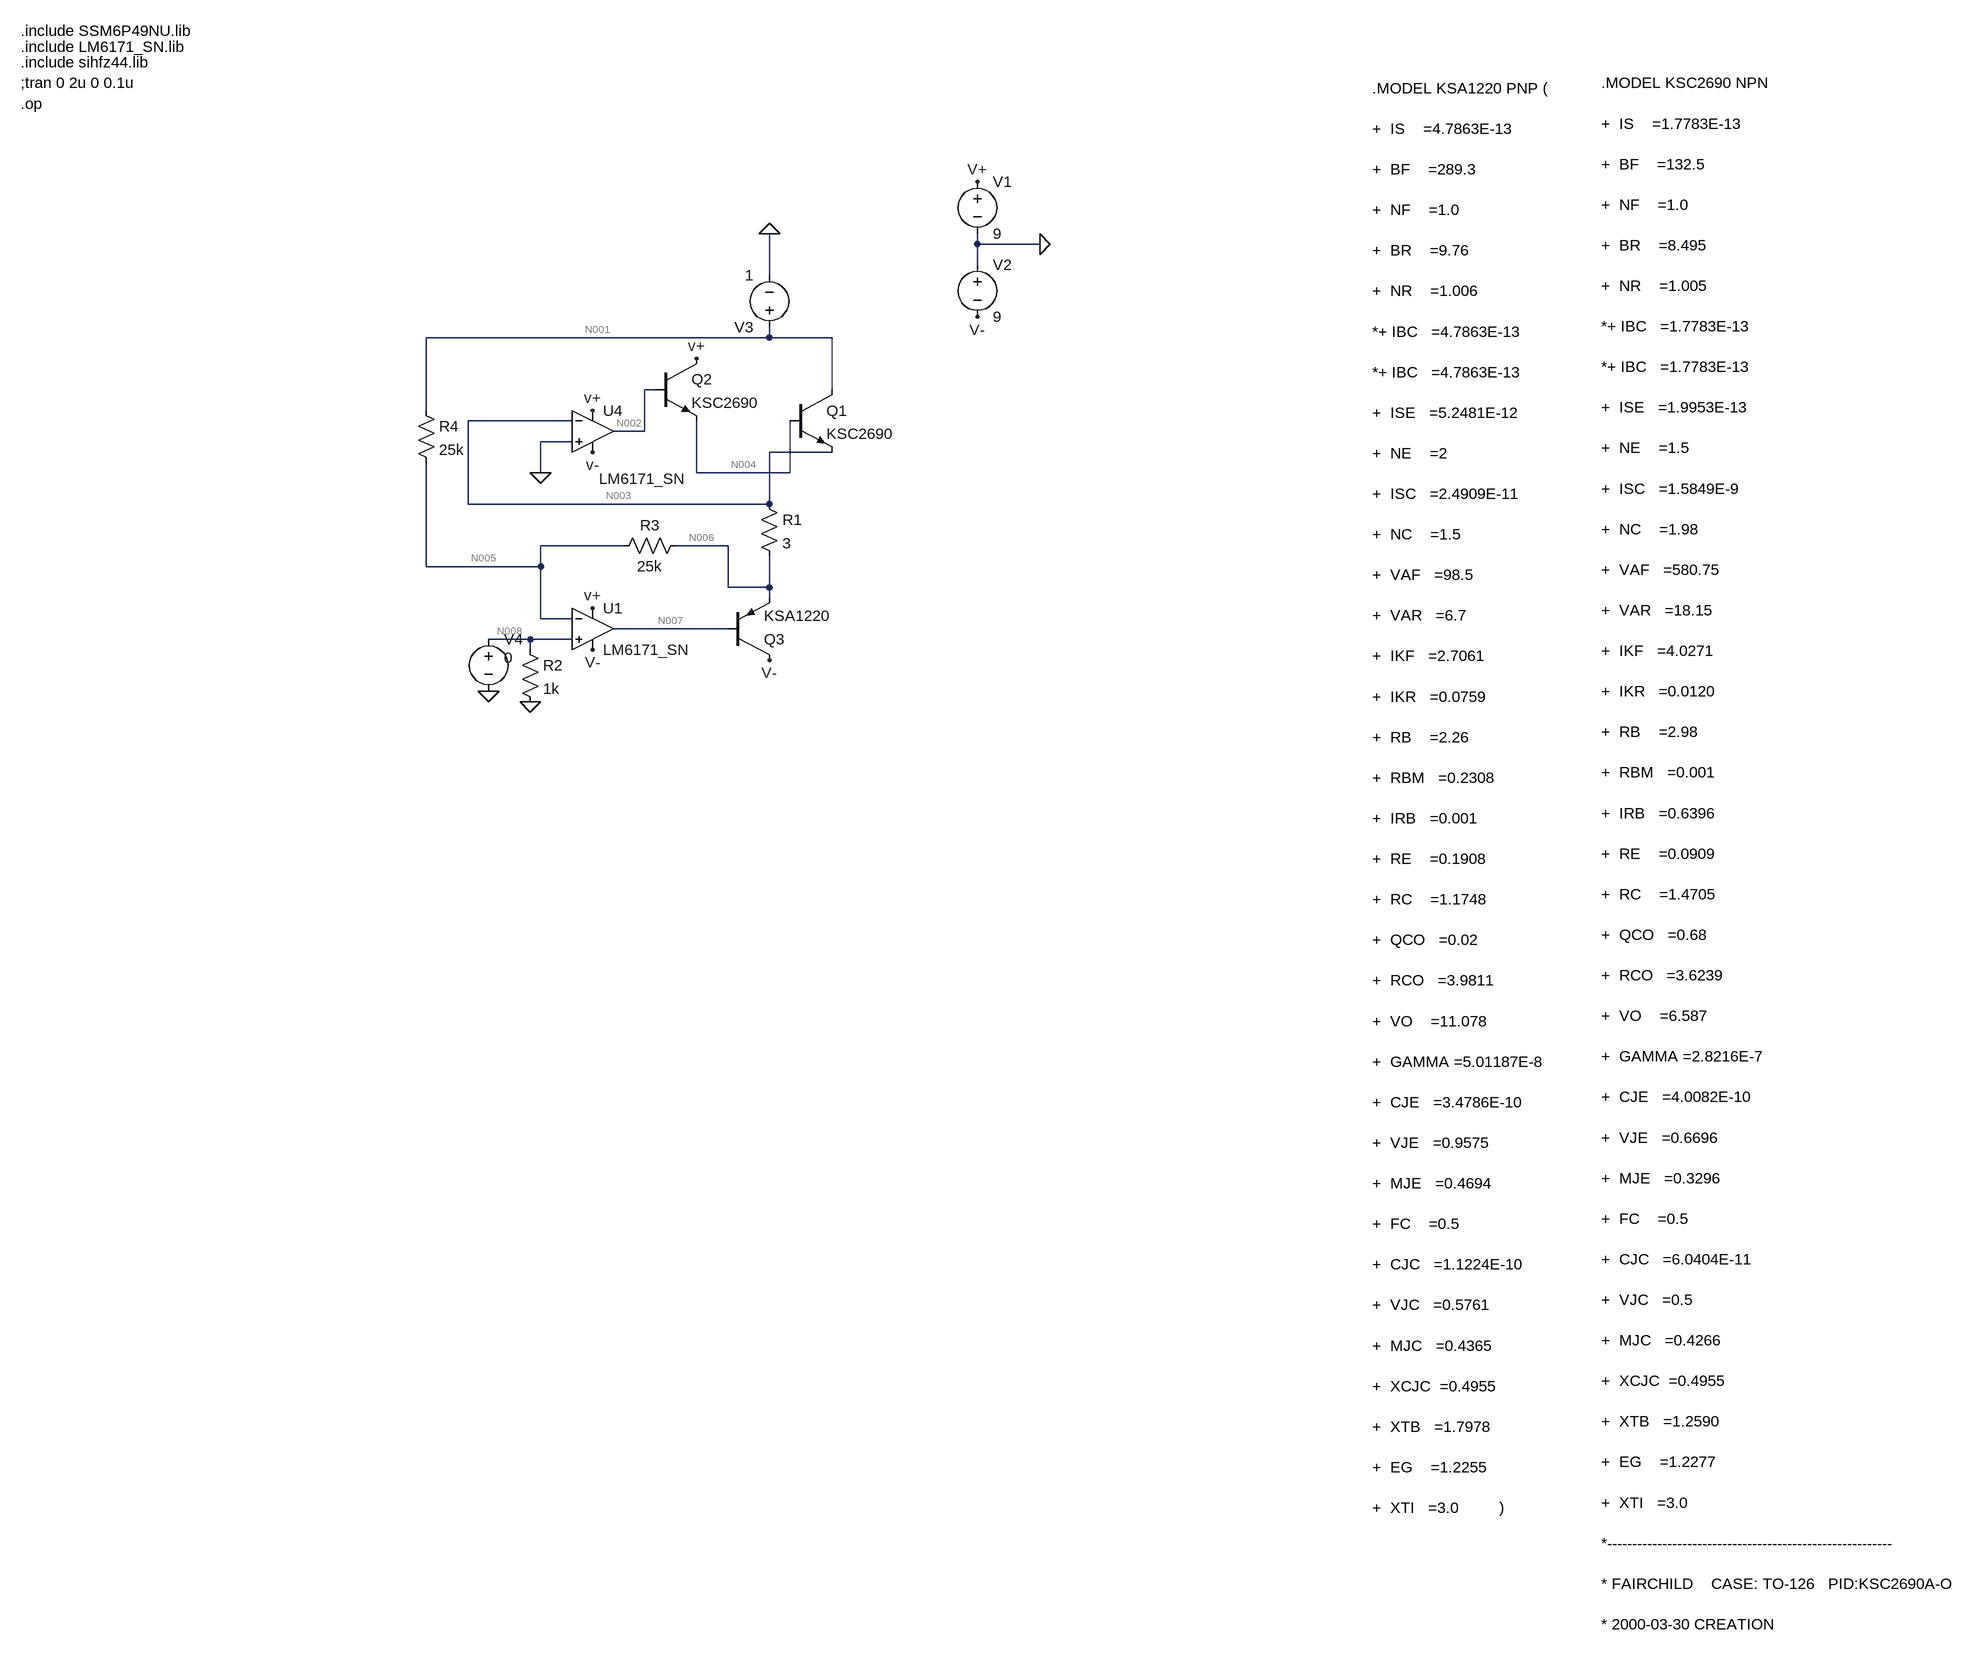
[diagram p0: schematic DC-DC_load.asc]
DC-DC_load.asc, the LTspice schematic file:
Version 4
SHEET 1 2640 680
WIRE 1056 -160 1056 -176
WIRE 1152 -160 1056 -160
WIRE 1056 -128 1056 -160
WIRE 736 -112 736 -176
WIRE 736 -16 736 -32
WIRE 736 -16 208 -16
WIRE 832 -16 736 -16
WIRE 560 64 544 64
WIRE 832 64 832 -16
WIRE 208 96 208 -16
WIRE 432 112 272 112
WIRE 544 128 544 64
WIRE 544 128 496 128
WIRE 432 144 384 144
WIRE 832 160 736 160
WIRE 384 192 384 144
WIRE 624 192 624 112
WIRE 768 192 768 112
WIRE 768 192 624 192
WIRE 272 240 272 112
WIRE 736 240 736 160
WIRE 736 240 272 240
WIRE 512 304 384 304
WIRE 672 304 592 304
WIRE 208 336 208 176
WIRE 384 336 384 304
WIRE 384 336 208 336
WIRE 672 368 672 304
WIRE 736 368 736 320
WIRE 736 368 672 368
WIRE 736 384 736 368
WIRE 384 416 384 336
WIRE 432 416 384 416
WIRE 672 432 496 432
WIRE 368 448 304 448
WIRE 432 448 368 448
WIRE 368 464 368 448
FLAG 464 96 v+
FLAG 464 160 v-
FLAG 1152 -160 0
FLAG 1056 -256 V+
FLAG 1056 -48 V-
FLAG 384 192 0
FLAG 736 480 V-
FLAG 464 464 V-
FLAG 464 400 v+
FLAG 736 -176 0
FLAG 368 544 0
FLAG 624 16 v+
FLAG 304 528 0
SYMBOL Opamps\\opamp2 464 368 R0
SYMATTR InstName U1
SYMATTR Value LM6171_SN
SYMBOL Opamps\\opamp2 464 64 R0
WINDOW 3 10 137 Left 2
SYMATTR Value LM6171_SN
SYMATTR InstName U4
SYMBOL voltage 1056 -272 R0
WINDOW 123 0 0 Left 2
WINDOW 39 0 0 Left 2
SYMATTR InstName V1
SYMATTR Value 9
SYMBOL voltage 1056 -144 R0
WINDOW 123 0 0 Left 2
WINDOW 39 0 0 Left 2
SYMATTR InstName V2
SYMATTR Value 9
SYMBOL npn 768 64 R0
SYMATTR InstName Q1
SYMATTR Value KSC2690
SYMBOL pnp 672 480 M180
SYMATTR InstName Q3
SYMATTR Value KSA1220
SYMBOL res 720 224 R0
SYMATTR InstName R1
SYMATTR Value 3
SYMBOL voltage 736 -16 R180
WINDOW 123 0 0 Left 2
WINDOW 39 -118 -3 Left 2
SYMATTR InstName V3
SYMATTR Value 1
SYMBOL voltage 304 432 R0
WINDOW 3 24 44 Left 2
WINDOW 123 0 0 Left 2
WINDOW 39 0 0 Left 2
SYMATTR Value 0
SYMATTR InstName V4
SYMBOL npn 560 16 R0
SYMATTR InstName Q2
SYMATTR Value KSC2690
SYMBOL res 352 448 R0
SYMATTR InstName R2
SYMATTR Value 1k
SYMBOL res 608 288 R90
WINDOW 0 0 56 VBottom 2
WINDOW 3 32 56 VTop 2
SYMATTR InstName R3
SYMATTR Value 25k
SYMBOL res 192 80 R0
SYMATTR InstName R4
SYMATTR Value 25k
TEXT -416 -376 Left 2 !.op
TEXT -416 -464 Left 2 !.include LM6171_SN.lib
TEXT -416 -408 Left 2 !;tran 0 2u 0 0.1u
TEXT -416 -440 Left 2 !.include sihfz44.lib
TEXT -416 -488 Left 2 !.include SSM6P49NU.lib
TEXT 1664 -400 Left 2 !.MODEL KSA1220 PNP ( \n\n+  IS    =4.7863E-13      \n\n+  BF    =289.3\n\n+  NF    =1.0 \n\n+  BR    =9.76\n\n+  NR    =1.006\n\n*+ IBC   =4.7863E-13\n\n*+ IBC   =4.7863E-13\n\n+  ISE   =5.2481E-12\n\n+  NE    =2\n\n+  ISC   =2.4909E-11\n\n+  NC    =1.5\n\n+  VAF   =98.5\n\n+  VAR   =6.7\n\n+  IKF   =2.7061\n\n+  IKR   =0.0759\n\n+  RB    =2.26\n\n+  RBM   =0.2308\n\n+  IRB   =0.001\n\n+  RE    =0.1908\n\n+  RC    =1.1748\n\n+  QCO   =0.02\n\n+  RCO   =3.9811\n\n+  VO    =11.078\n\n+  GAMMA =5.01187E-8\n\n+  CJE   =3.4786E-10\n\n+  VJE   =0.9575\n\n+  MJE   =0.4694\n\n+  FC    =0.5\n\n+  CJC   =1.1224E-10\n\n+  VJC   =0.5761\n\n+  MJC   =0.4365\n\n+  XCJC  =0.4955   \n\n+  XTB   =1.7978    \n\n+  EG    =1.2255 \n\n+  XTI   =3.0         )
TEXT 2016 -408 Left 2 !.MODEL KSC2690 NPN\n\n+  IS    =1.7783E-13      \n\n+  BF    =132.5\n\n+  NF    =1.0 \n\n+  BR    =8.495\n\n+  NR    =1.005\n\n*+ IBC   =1.7783E-13 \n\n*+ IBC   =1.7783E-13 \n\n+  ISE   =1.9953E-13\n\n+  NE    =1.5\n\n+  ISC   =1.5849E-9\n\n+  NC    =1.98\n\n+  VAF   =580.75\n\n+  VAR   =18.15\n\n+  IKF   =4.0271\n\n+  IKR   =0.0120\n\n+  RB    =2.98\n\n+  RBM   =0.001\n\n+  IRB   =0.6396\n\n+  RE    =0.0909\n\n+  RC    =1.4705\n\n+  QCO   =0.68\n\n+  RCO   =3.6239\n\n+  VO    =6.587\n\n+  GAMMA =2.8216E-7\n\n+  CJE   =4.0082E-10\n\n+  VJE   =0.6696\n\n+  MJE   =0.3296\n\n+  FC    =0.5\n\n+  CJC   =6.0404E-11\n\n+  VJC   =0.5\n\n+  MJC   =0.4266\n\n+  XCJC  =0.4955   \n\n+  XTB   =1.2590    \n\n+  EG    =1.2277 \n\n+  XTI   =3.0         \n\n*---------------------------------------------------------\n\n* FAIRCHILD    CASE: TO-126   PID:KSC2690A-O\n\n* 2000-03-30 CREATION

The netlist it stands for:
* DC-DC_load.asc
XU1 N008 N005 v+ v- N007 LM6171_SN  ; pins In+ In- V+ V- OUT
XU4 0 N003 v+ v- N002 LM6171_SN  ; pins In+ In- V+ V- OUT
V1 v+ 0 9
V2 0 v- 9
Q1 N001 N004 N003 0 KSC2690
Q3 v- N007 N006 0 KSA1220
R1 N003 N006 3
V3 N001 0 1
V4 N008 0 0
Q2 v+ N002 N004 0 KSC2690
R2 N008 0 1k
R3 N006 N005 25k
R4 N001 N005 25k
.model NPN NPN
.model PNP PNP
.lib standard.bjt
.op
.include LM6171_SN.lib
;tran 0 2u 0 0.1u
.include sihfz44.lib
.include SSM6P49NU.lib
.MODEL KSA1220 PNP (
+  IS    =4.7863E-13
+  BF    =289.3
+  NF    =1.0
+  BR    =9.76
+  NR    =1.006
*+ IBC   =4.7863E-13
*+ IBC   =4.7863E-13
+  ISE   =5.2481E-12
+  NE    =2
+  ISC   =2.4909E-11
+  NC    =1.5
+  VAF   =98.5
+  VAR   =6.7
+  IKF   =2.7061
+  IKR   =0.0759
+  RB    =2.26
+  RBM   =0.2308
+  IRB   =0.001
+  RE    =0.1908
+  RC    =1.1748
+  QCO   =0.02
+  RCO   =3.9811
+  VO    =11.078
+  GAMMA =5.01187E-8
+  CJE   =3.4786E-10
+  VJE   =0.9575
+  MJE   =0.4694
+  FC    =0.5
+  CJC   =1.1224E-10
+  VJC   =0.5761
+  MJC   =0.4365
+  XCJC  =0.4955
+  XTB   =1.7978
+  EG    =1.2255
+  XTI   =3.0         )
.MODEL KSC2690 NPN
+  IS    =1.7783E-13
+  BF    =132.5
+  NF    =1.0
+  BR    =8.495
+  NR    =1.005
*+ IBC   =1.7783E-13
*+ IBC   =1.7783E-13
+  ISE   =1.9953E-13
+  NE    =1.5
+  ISC   =1.5849E-9
+  NC    =1.98
+  VAF   =580.75
+  VAR   =18.15
+  IKF   =4.0271
+  IKR   =0.0120
+  RB    =2.98
+  RBM   =0.001
+  IRB   =0.6396
+  RE    =0.0909
+  RC    =1.4705
+  QCO   =0.68
+  RCO   =3.6239
+  VO    =6.587
+  GAMMA =2.8216E-7
+  CJE   =4.0082E-10
+  VJE   =0.6696
+  MJE   =0.3296
+  FC    =0.5
+  CJC   =6.0404E-11
+  VJC   =0.5
+  MJC   =0.4266
+  XCJC  =0.4955
+  XTB   =1.2590
+  EG    =1.2277
+  XTI   =3.0
*---------------------------------------------------------
* FAIRCHILD    CASE: TO-126   PID:KSC2690A-O
* 2000-03-30 CREATION
.backanno
.end

* Results of the author's LTspice run, read from the files saved beside the schematic
* Operating Point:
*   V(n008) = 0 V
*   V(v+) = 9 V
*   V(n005) = 1.947 mV
*   V(v-) = -9 V
*   V(n007) = -1.744 V
*   V(n003) = 1.808 mV
*   V(n002) = 1.386 V
*   V(n001) = 1 V
*   V(n004) = 775.2 mV
*   V(n006) = -971.8 mV
*   Ic(Q3) = -323.3 mA
*   Ib(Q3) = -1.33 mA
*   Ie(Q3) = 324.6 mA
*   Ic(Q2) = 3.134 mA
*   Ib(Q2) = 25.54 µA
*   Ie(Q2) = -3.159 mA
*   Ic(Q1) = 321.4 mA
*   Ib(Q1) = 3.159 mA
*   Ie(Q1) = -324.6 mA
*   I(R4) = 39.92 µA
*   I(R3) = -38.95 µA
*   I(R2) = 0 A
*   I(R1) = 324.6 mA
*   I(V4) = -999.6 nA
*   I(V3) = -321.4 mA
*   I(V2) = -328.8 mA
*   I(V1) = -7.319 mA
*   Ix(u1:1) = 999.6 nA
*   Ix(u1:2) = 970.4 nA
*   Ix(u1:3) = 2.08 mA
*   Ix(u1:4) = -3.41 mA
*   Ix(u1:5) = 1.33 mA
*   Ix(u4:1) = 999.6 nA
*   Ix(u4:2) = 970.4 nA
*   Ix(u4:3) = 2.106 mA
*   Ix(u4:4) = -2.08 mA
*   Ix(u4:5) = -25.54 µA
* From the log:
*   Semiconductor Device Operating Points:
*                           --- Diodes ---
*   Name:    d:u4:8      d:u4:6      d:u4:7      d:u4:5      d:u4:18
*   Model:    u4:db      u4:dnc      u4:dnc       u4:dn       u4:dy
*   Id:     -1.80e-11    8.85e-11    8.85e-11    8.85e-11   -1.74e-11
*   Vd:     -1.80e+01    2.35e-01    2.35e-01    2.35e-01   -1.74e+01
*   Req:     1.00e+12    2.93e+08    2.93e+08    2.93e+08    1.00e+12
*   CAP:     0.00e+00    0.00e+00    0.00e+00    0.00e+00    0.00e+00
*   Name:    d:u4:16     d:u4:14     d:u4:13     d:u4:20     d:u4:19
*   Model:    u4:dy       u4:dx       u4:dx       u4:dx       u4:dx
*   Id:     -1.27e-05   -5.51e-10   -5.39e-10   -8.99e-10   -6.19e-10
*   Vd:     -5.03e+01   -5.51e+02   -5.39e+02   -8.99e+02   -6.19e+02
*   Req:     2.03e+03    1.00e+12    1.00e+12    1.00e+12    1.00e+12
*   CAP:     0.00e+00    0.00e+00    0.00e+00    0.00e+00    0.00e+00
*   Name:    d:u4:15     d:u4:17     d:u4:10     d:u4:12     d:u4:11
*   Model:    u4:dx       u4:dx       u4:dx       u4:dx       u4:dx
*   Id:     -3.23e-11    1.28e-05   -5.25e-08   -5.25e-08   -5.25e-08
*   Vd:     -3.23e+01    6.02e-01   -5.25e+04   -5.25e+04   -5.25e+04
*   Req:     1.00e+12    2.02e+03    1.00e+12    1.00e+12    1.00e+12
*   CAP:     0.00e+00    0.00e+00    0.00e+00    0.00e+00    0.00e+00
*   Name:    d:u4:9      d:u4:4      d:u4:2      d:u4:3      d:u4:1
*   Model:    u4:dx       u4:dx       u4:dx       u4:dx       u4:dx
*   Id:     -5.25e-08   -9.00e-12   -9.00e-12   -9.00e-12   -9.00e-12
*   Vd:     -5.25e+04   -9.00e+00   -9.00e+00   -9.00e+00   -9.00e+00
*   Req:     1.00e+12    1.00e+12    1.00e+12    1.00e+12    1.00e+12
*   CAP:     0.00e+00    0.00e+00    0.00e+00    0.00e+00    0.00e+00
*   Name:    d:u1:8      d:u1:6      d:u1:7      d:u1:5      d:u1:18
*   Model:    u1:db      u1:dnc      u1:dnc       u1:dn       u1:dy
*   Id:     -1.80e-11    8.85e-11    8.85e-11    8.85e-11   -6.65e-04
*   Vd:     -1.80e+01    2.35e-01    2.35e-01    2.35e-01   -5.04e+01
*   Req:     1.00e+12    2.93e+08    2.93e+08    2.93e+08    3.89e+01
*   CAP:     0.00e+00    0.00e+00    0.00e+00    0.00e+00    0.00e+00
*   Name:    d:u1:16     d:u1:14     d:u1:13     d:u1:20     d:u1:19
*   Model:    u1:dy       u1:dx       u1:dx       u1:dx       u1:dx
*   Id:     -1.73e-11   -5.43e-10   -5.47e-10   -5.78e-10   -9.37e-10
*   Vd:     -1.73e+01   -5.43e+02   -5.47e+02   -5.78e+02   -9.37e+02
*   Req:     1.00e+12    1.00e+12    1.00e+12    1.00e+12    1.00e+12
*   CAP:     0.00e+00    0.00e+00    0.00e+00    0.00e+00    0.00e+00
*   Name:    d:u1:15     d:u1:17     d:u1:10     d:u1:12     d:u1:11
*   Model:    u1:dx       u1:dx       u1:dx       u1:dx       u1:dx
*   Id:      6.65e-04   -3.24e-11   -5.25e-08   -5.25e-08   -5.25e-08
*   Vd:      7.04e-01   -3.24e+01   -5.25e+04   -5.25e+04   -5.25e+04
*   Req:     3.89e+01    1.00e+12    1.00e+12    1.00e+12    1.00e+12
*   CAP:     0.00e+00    0.00e+00    0.00e+00    0.00e+00    0.00e+00
*   Name:    d:u1:9      d:u1:4      d:u1:2      d:u1:3      d:u1:1
*   Model:    u1:dx       u1:dx       u1:dx       u1:dx       u1:dx
*   Id:     -5.25e-08   -9.00e-12   -9.00e-12   -9.00e-12   -9.00e-12
*   Vd:     -5.25e+04   -9.00e+00   -9.00e+00   -9.00e+00   -9.00e+00
*   Req:     1.00e+12    1.00e+12    1.00e+12    1.00e+12    1.00e+12
*   CAP:     0.00e+00    0.00e+00    0.00e+00    0.00e+00    0.00e+00
*                           --- Bipolar Transistors ---
*   Name:       q3          q2          q1
*   Model:    ksa1220     ksc2690     ksc2690
*   Ib:      -1.33e-03    2.55e-05    3.16e-03
*   Ic:      -3.23e-01    3.13e-03    3.21e-01
*   Vbe:     -7.72e-01    6.11e-01    7.73e-01
*   Vbc:      7.26e+00   -7.61e+00   -2.25e-01
*   Vce:     -8.03e+00    8.22e+00    9.98e-01
*   BetaDC:   2.43e+02    1.23e+02    1.02e+02
*   Gm:       1.12e+01    1.21e-01    1.10e+01
*   Rpi:      1.95e+01    1.03e+03    8.85e+00
*   Rx:       1.17e+00    2.98e+00    2.95e+00
*   Ro:       2.89e+02    1.82e+05    1.66e+00
*   Cbe:      5.90e-10    6.41e-10    7.02e-10
*   Cbc:      2.00e-11    9.12e-12    6.28e-11
*   Cjs:      0.00e+00    0.00e+00    0.00e+00
*   BetaAC:   2.18e+02    1.25e+02    9.76e+01
*   Cbx:      2.04e-11    9.29e-12    6.46e-11
*   Ft:       2.82e+09    2.92e+07    2.12e+09